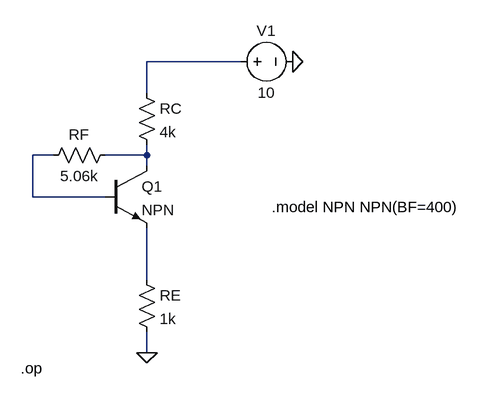
[diagram p0: schematic Lab6_2.asc]
Lab6_2.asc, the LTspice schematic file:
Version 4
SHEET 1 880 680
WIRE 192 -48 48 -48
WIRE 48 0 48 -48
WIRE -96 96 -128 96
WIRE 48 96 48 80
WIRE 48 96 -16 96
WIRE 48 112 48 96
WIRE -128 160 -128 96
WIRE -16 160 -128 160
WIRE 48 288 48 208
WIRE 48 400 48 368
FLAG 48 400 0
FLAG 272 -48 0
SYMBOL res 32 -16 R0
SYMATTR InstName RC
SYMATTR Value 4k
SYMBOL res 32 272 R0
SYMATTR InstName RE
SYMATTR Value 1k
SYMBOL voltage 176 -48 R270
WINDOW 0 32 56 VTop 2
WINDOW 3 -32 56 VBottom 2
WINDOW 123 0 0 Left 0
WINDOW 39 0 0 Left 0
SYMATTR InstName V1
SYMATTR Value 10
SYMBOL npn -16 112 R0
SYMATTR InstName Q1
SYMBOL res 0 80 R90
WINDOW 0 0 56 VBottom 2
WINDOW 3 32 56 VTop 2
SYMATTR InstName RF
SYMATTR Value 5.06k
TEXT -146 424 Left 2 !.op
TEXT 240 176 Left 2 !.model NPN NPN(BF=400)

The netlist it stands for:
* Lab6_2.asc
RC N001 N003 4k
RE N004 0 1k
V1 N001 0 10
Q1 N003 N002 N004 0 NPN
RF N003 N002 5.06k
.model NPN NPN
.model PNP PNP
.lib standard.bjt
.op
.model NPN NPN(BF=400)
.backanno
.end